# Altium schematic sheet control1.SchDoc
size A4
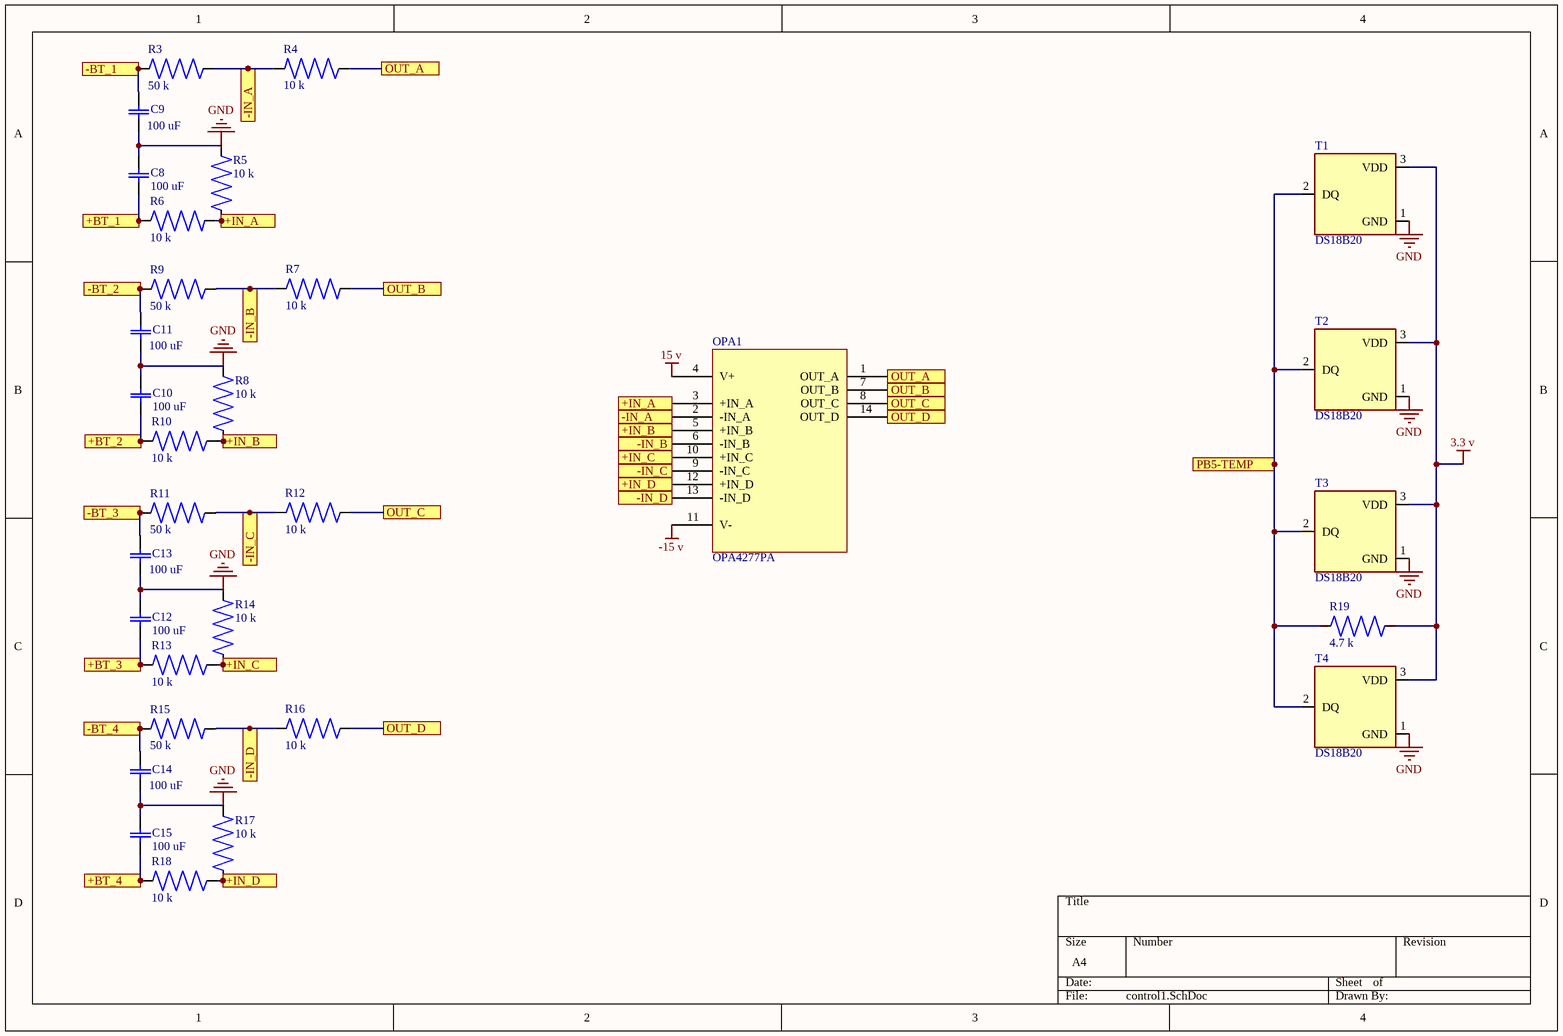
[diagram p0: control1.SchDoc]

## Parts
C8  100 uF  [0805-c]
C9  100 uF  [0805-c]
C10  100 uF  [0805-c]
C11  100 uF  [0805-c]
C12  100 uF  [0805-c]
C13  100 uF  [0805-c]
C14  100 uF  [0805-c]
C15  100 uF  [0805-c]
OPA1  OPA4277PA  [OPA4277PA]
R3  50 k  [10 k]
R4  10 k  [10 k]
R5  10 k  [10 k]
R6  10 k  [10 k]
R7  10 k  [10 k]
R8  10 k  [10 k]
R9  50 k  [10 k]
R10  10 k  [10 k]
R11  50 k  [10 k]
R12  10 k  [10 k]
R13  10 k  [10 k]
R14  10 k  [10 k]
R15  50 k  [10 k]
R16  10 k  [10 k]
R17  10 k  [10 k]
R18  10 k  [10 k]
R19  4.7 k  [10 k]
T1  DS18B20  [DS18B20]
T2  DS18B20  [DS18B20]
T3  DS18B20  [DS18B20]
T4  DS18B20  [DS18B20]

## Ports
+BT_1, +BT_2, +BT_3, +BT_4, +IN_A, +IN_B, +IN_C, +IN_D, -BT_1, -BT_2, -BT_3, -BT_4, -IN_A, -IN_B, -IN_C, -IN_D, OUT_A, OUT_B, OUT_C, OUT_D, PB5-TEMP

## Nets
3.3 v: R19.2 T1.3(VDD) T2.3(VDD) T3.3(VDD) T4.3(VDD)
15 v: OPA1.4(V+)
-15 v: OPA1.11(V-)
GND: C8.1(C1) C9.2(C2) C10.1(C1) C11.2(C2) C12.1(C1) C13.2(C2) C14.2(C2) C15.1(C1) R5.1 R8.1 R14.1 R17.1 T1.1(GND) T2.1(GND) T3.1(GND) T4.1(GND)
+BT_1: C8.2(C2) R6.2 ; port +BT_1
+BT_2: C10.2(C2) R10.2 ; port +BT_2
+BT_3: C12.2(C2) R13.2 ; port +BT_3
+BT_4: C15.2(C2) R18.2 ; port +BT_4
+IN_A: OPA1.3(+IN_A) R5.2 R6.1 ; port +IN_A
+IN_B: OPA1.5(+IN_B) R8.2 R10.1 ; port +IN_B
+IN_C: OPA1.10(+IN_C) R13.1 R14.2 ; port +IN_C
+IN_D: OPA1.12(+IN_D) R17.2 R18.1 ; port +IN_D
-BT_1: C9.1(C1) R3.1 ; port -BT_1
-BT_2: C11.1(C1) R9.1 ; port -BT_2
-BT_3: C13.1(C1) R11.1 ; port -BT_3
-BT_4: C14.1(C1) R15.1 ; port -BT_4
-IN_A: OPA1.2(-IN_A) R3.2 R4.1 ; port -IN_A
-IN_B: OPA1.6(-IN_B) R7.1 R9.2 ; port -IN_B
-IN_C: OPA1.9(-IN_C) R11.2 R12.1 ; port -IN_C
-IN_D: OPA1.13(-IN_D) R15.2 R16.1 ; port -IN_D
OUT_A: OPA1.1(OUT_A) R4.2 ; port OUT_A
OUT_B: OPA1.7(OUT_B) R7.2 ; port OUT_B
OUT_C: OPA1.8(OUT_C) R12.2 ; port OUT_C
OUT_D: OPA1.14(OUT_D) R16.2 ; port OUT_D
PB5-TEMP: R19.1 T1.2(DQ) T2.2(DQ) T3.2(DQ) T4.2(DQ) ; port PB5-TEMP

## Library data of the parts
C8-C15 = 0805-C
R3 R9 R11 R15 R19 = 10 k